# EAGLE design SparkFun_miniUSB_Breakout_v13 (EAGLE 7.2.0)
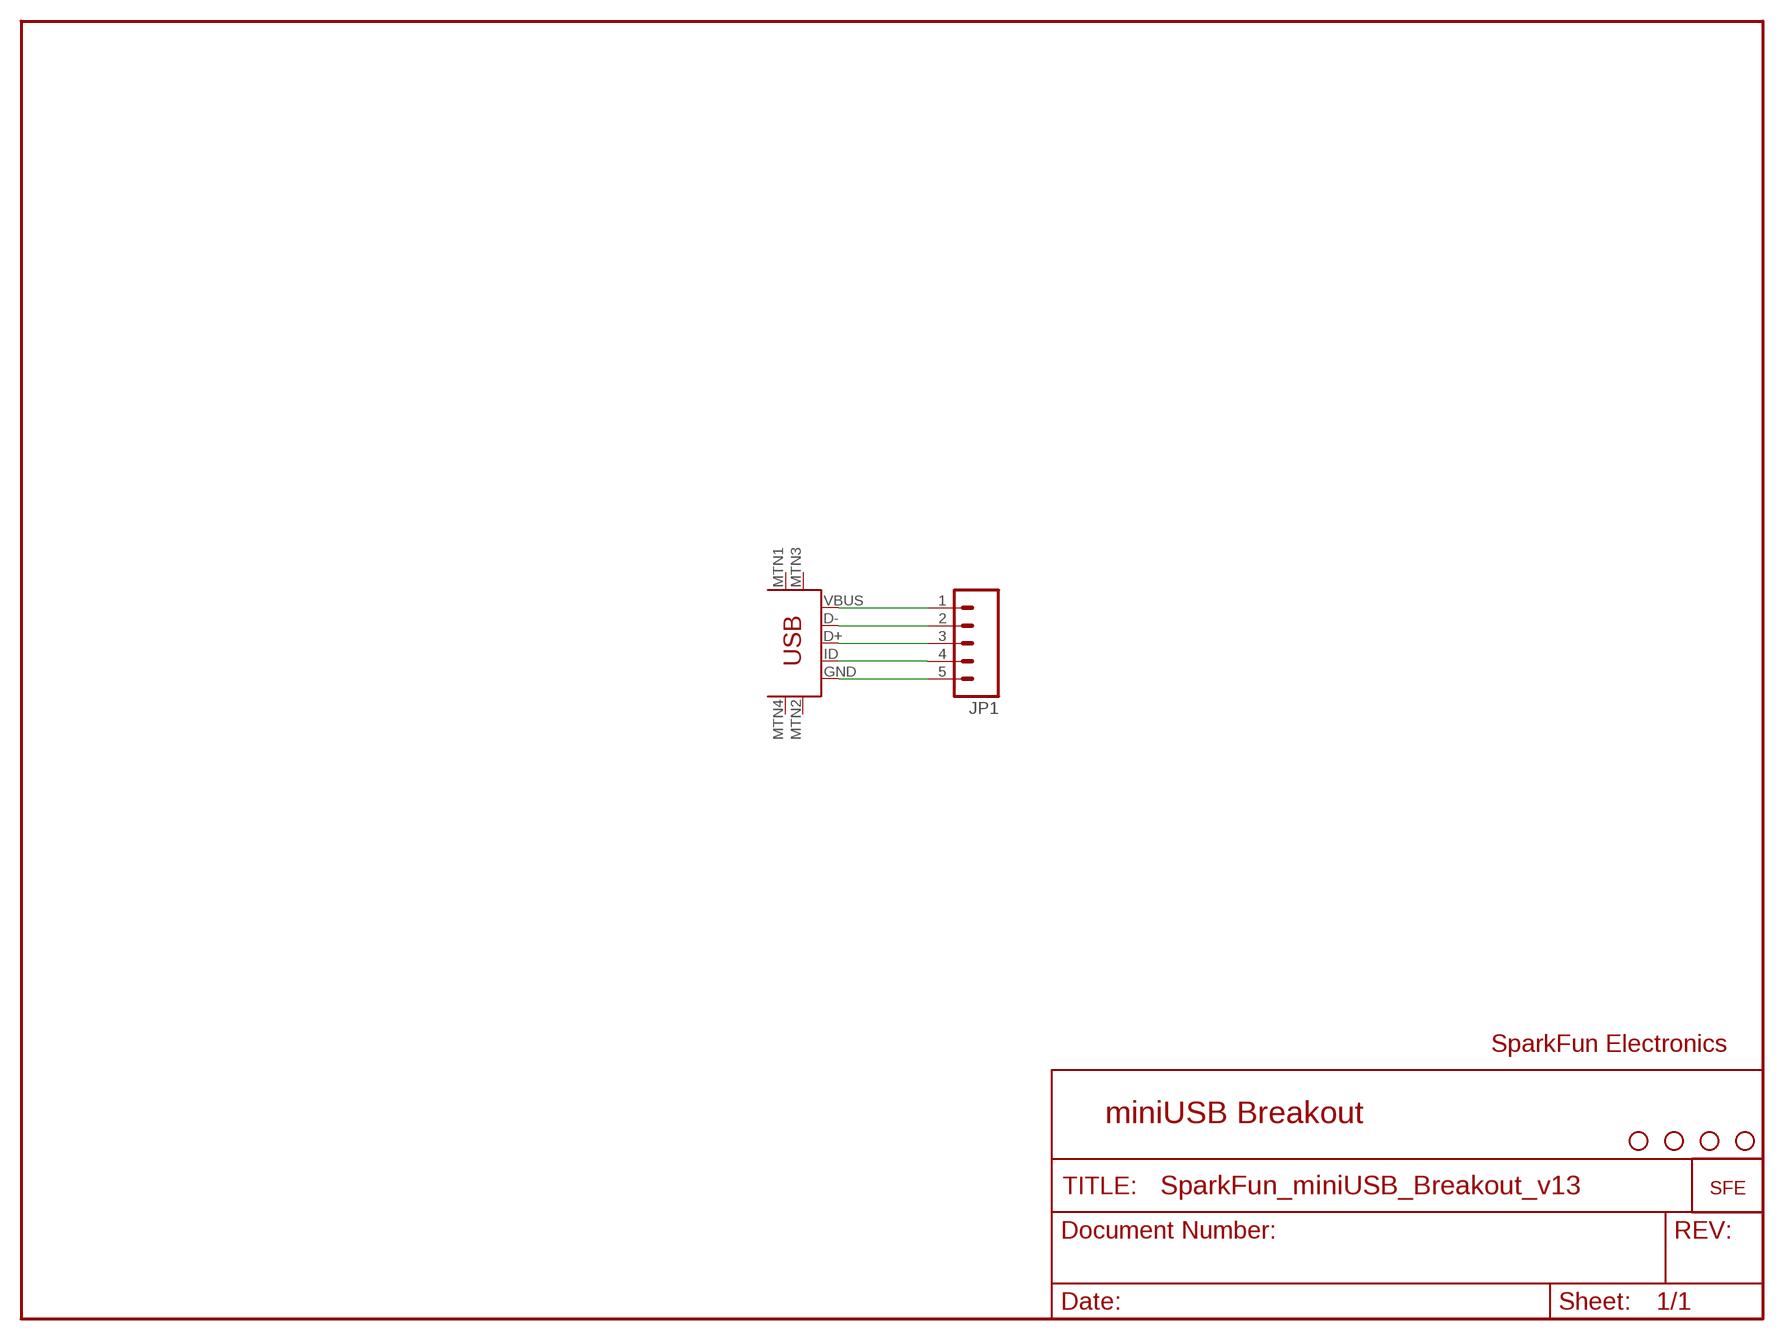
[diagram p0: schematic, sheet 1]

## Parts
JP1  M05PTH  [1X05]
U$1  USB-MINIB-5PIN  [USB-MINIB]
U$2  STAND-OFF  [STAND-OFF]
U$3  STAND-OFF  [STAND-OFF]
U$4  STAND-OFF  [STAND-OFF]
U$5  STAND-OFF  [STAND-OFF]
U$6  LOGO-SFENEW  [SFE-NEW-WEBLOGO]

## Nets
GND: JP1.5 U$1.GND
N$1: JP1.2 U$1.D-
N$2: JP1.1 U$1.VBUS
N$3: JP1.3 U$1.D+
N$5: JP1.4 U$1.ID
Unconnected: U$1.MTN1(MTN2) U$1.MTN2(MTN3) U$1.MTN3(MTN1) U$1.MTN4

## Notes on the sheet
- SparkFun Electronics
- miniUSB Breakout

## Library data of the parts
JP1 = SparkFun:M05: Header 5 Standard 5-pin 0.1" header. Use with straight break away headers (SKU : PRT-00116), right angle break away headers (PRT-00553), swiss pins (PRT-00743), machine pins (PRT-00117), and female headers (PRT-00115). Molex polarized connector foot print use with SKU : PRT-08230 with associated crimp pins and housings.
U$1 = SparkFun:USB-MINIB
U$2-U$5 = SparkFun:STAND-OFF: Stand Off This is the mechanical footprint for a #4 phillips button head screw. Use the keepout ring to avoid running the screw head into surrounding components. SKU : PRT-00447
U$6 = SparkFun:LOGO-SFE: Spark Fun Electronics PCB Logo This is the standard Spark Fun Electronics PCB logo.

## Net classes
0 default: width 0.203 mm
1 power: width 0.305 mm

## Board
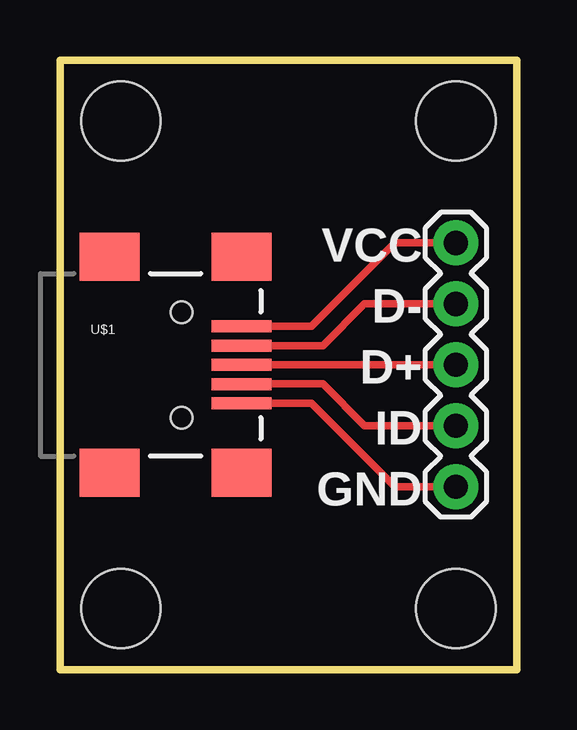
[diagram p1: board, top side]
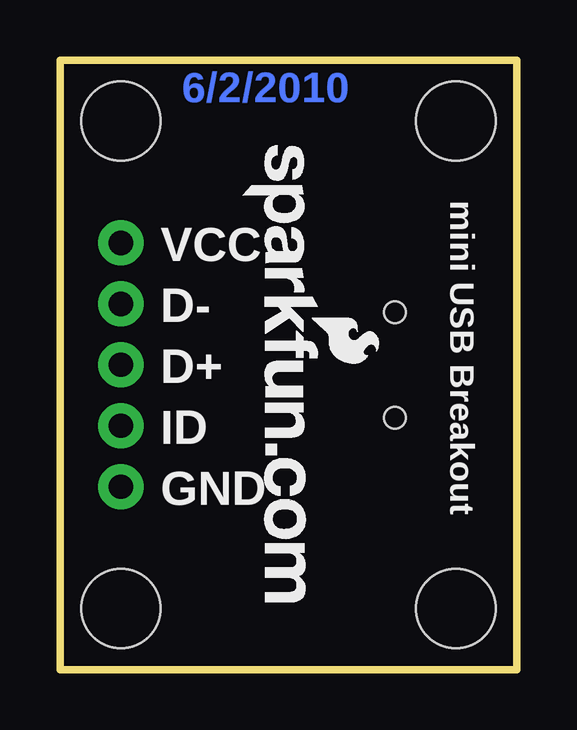
[diagram p2: board, bottom side, seen from below]

Size 19.05 x 25.4 mm. Coordinates in mm from the lower left corner, seen from the top.
Outline: 0,25.4 19.05,25.4 19.05,0 0,0 0,25.4
Copper layers (1*16): Top 0.035mm / dielectric 1.5mm / Bottom 0.035mm
Design rules "SparkFun": minimum track width 8mil, minimum drill 20mil, track to track 8mil, track to pad 8mil, pad to pad 8mil, via to via 8mil, smd to smd 8mil, copper to edge 10mil, drill to drill 8mil, minimum pad ring 12mil, minimum via ring 10mil, stop-mask expansion 4mil, vias tented up to drill 20mil, thermal gap 10mil

### Footprints (pad centres in the part's own frame; a part is rotated, then mirrored left to right if it is on the bottom)
1X05 = drill 1.016 pad 1.88 round: 1 0,0; 2 2.54,0; 3 5.08,0; 4 7.62,0; 5 10.16,0
USB-MINIB = smd 2.5 x 0.5: D+ 2.5,0; D- 2.5,0.8; GND 2.5,-1.6; ID 2.5,-0.8; VBUS 2.5,1.6 | smd 2.5 x 2: MTN1 -3,4.5; MTN2 2.5,4.5; MTN3 -3,-4.5; MTN4 2.5,-4.5 | hole 0.9: 0,2.2; 0,-2.2
STAND-OFF = hole 3.302: 0,0

### Placement (x,y rotation side)
JP1  16.51,17.78 270 top
U$1  5.08,12.7 0 top
U$2  16.51,2.54 0 top
U$3  2.54,2.54 0 top
U$4  2.54,22.86 0 top
U$5  16.51,22.86 0 top
U$6  11.43,21.84 270 bottom

### Tracks (layer width: path | path; a pad name or v marks a point on that pad's centre or on a via)
GND
  Top 0.305: U$1.GND 10.49,11.1 13.97,7.62 JP1.5
N$1
  Top 0.305: U$1.D- 10.96,13.5 12.7,15.24 JP1.2
N$2
  Top 0.305: U$1.VBUS 10.49,14.3 13.97,17.78 JP1.1
N$3
  Top 0.305: U$1.D+ JP1.3
N$5
  Top 0.305: U$1.ID 10.96,11.9 12.7,10.16 JP1.4

### Text on the board
Bottom: 6/2/2010
tPlace: VCC | D- | D+ | ID | GND
bPlace: mini USB Breakout | VCC | D- | D+ | ID | GND